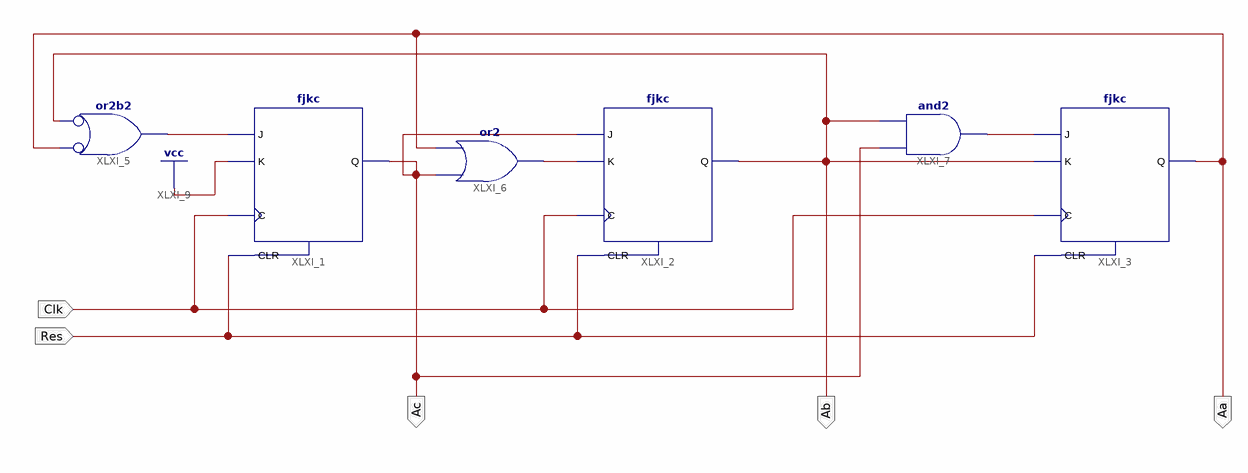
[diagram p0: schematic sheet 1]
// Xilinx ISE schematic counter.sch (xc9500xl) as structural Verilog: 6 symbols, 5 ports
module counter (
  input  Clk,
  input  Res,
  output Ac,
  output Ab,
  output Aa
);

  wire XLXN_1, XLXN_2, XLXN_3;

  fjkc XLXI_1 (.C(Clk), .CLR(Res), .J(XLXN_1), .K(1'b1), .Q(Ac));
  fjkc XLXI_2 (.C(Clk), .CLR(Res), .J(Ac), .K(XLXN_2), .Q(Ab));
  fjkc XLXI_3 (.C(Clk), .CLR(Res), .J(XLXN_3), .K(Ab), .Q(Aa));
  or XLXI_5 (XLXN_1, ~Aa, ~Ab);  // or2b2
  or XLXI_6 (XLXN_2, Ac, Aa);
  and XLXI_7 (XLXN_3, Ac, Ab);
endmodule
